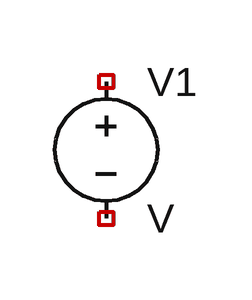
[diagram p0: schematic Power.asc]
Power.asc, the LTspice schematic file:
Version 4.1
SHEET 1 880 680
SYMBOL voltage -16 80 R0
SYMATTR InstName V1

The netlist it stands for:
* Power.asc
V1 NC_01 NC_02 V
.backanno
.end